# EAGLE design sterownik_led (EAGLE 9.5.2)
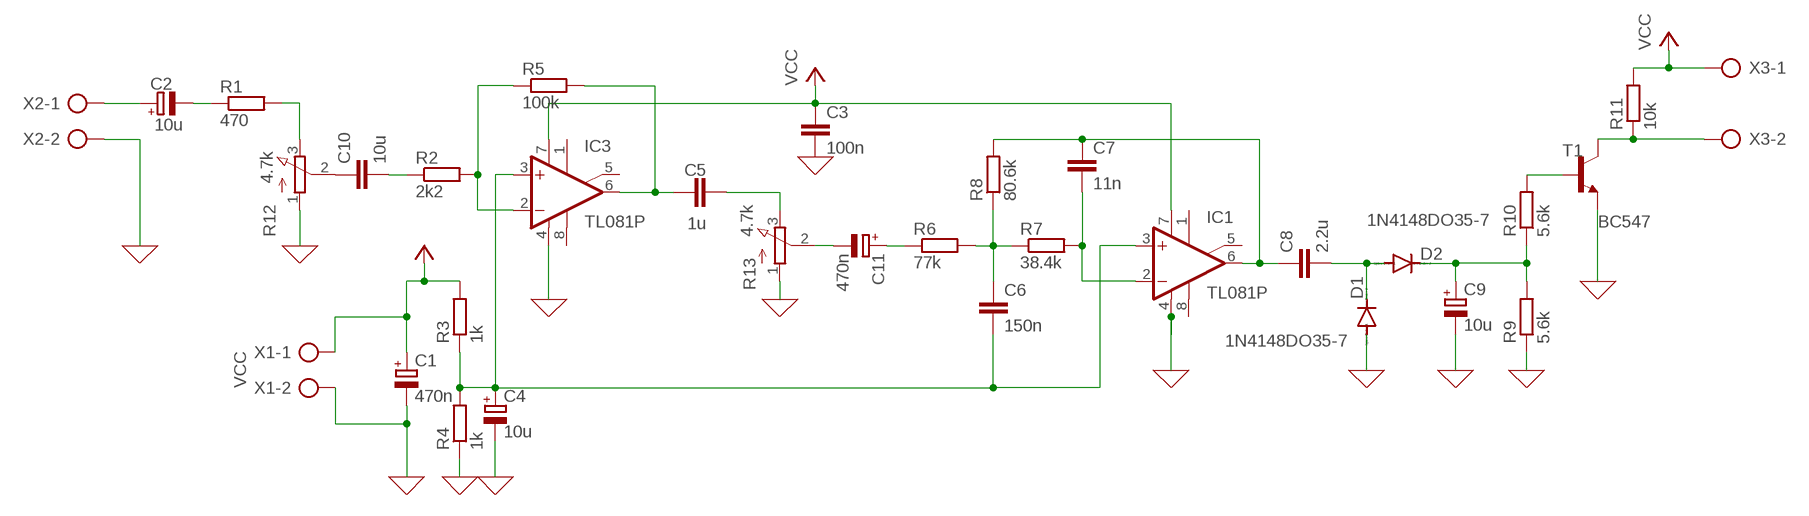
[diagram p0: schematic, sheet 1]

## Parts
C1  470n  CPOL-EUTT2D7  [TT2D7]
C2  10u  CPOL-EUTT2D7  [TT2D7]
C3  100n  C-EU025-025X050  [C025-025X050]
C4  10u  CPOL-EUTT2D7  [TT2D7]
C5  1u  C-EU025-025X050  [C025-025X050]
C6  150n  C-EU025-025X050  [C025-025X050]
C7  11n  C-EU025-025X050  [C025-025X050]
C8  2.2u  C-EU025-025X050  [C025-025X050]
C9  10u  CPOL-EUTT2D7  [TT2D7]
C10  10u  C-EU050-025X075  [C050-025X075]
C11  470n  CPOL-EUTT2D7  [TT2D7]
D1  1N4148DO35-7  [DO35-7]
D2  1N4148DO35-7  [DO35-7]
IC1  TL081P  [DIL08]
IC3  TL081P  [DIL08]
R1  470  R-EU_0207/10  [0207/10]
R2  2k2  R-EU_0207/10  [0207/10]
R3  1k  R-EU_0207/10  [0207/10]
R4  1k  R-EU_0207/10  [0207/10]
R5  100k  R-EU_0207/10  [0207/10]
R6  77k  R-EU_0207/10  [0207/10]
R7  38.4k  R-EU_0207/10  [0207/10]
R8  80.6k  R-EU_0207/10  [0207/10]
R9  5.6k  R-EU_0207/10  [0207/10]
R10  5.6k  R-EU_0207/10  [0207/10]
R11  10k  R-EU_0207/10  [0207/10]
R12  4.7k  3RP/1610N  [3RP/1610N]
R13  4.7k  3RP/1610N  [3RP/1610N]
T1  BC547  [TO92]
X1  AK500/2  [AK500/2]
X2  AK500/2  [AK500/2]
X3  AK500/2  [AK500/2]

## Nets
0: C1.- C3.2 C4.- C9.- D1.A IC1.4(V-) IC3.4(V-) R4.1 R9.1 R12.1(A) R13.1(A) T1.1(E) X1.2 X2.2 ; supply symbol labelled GND
JACK_VIN: C2.+ X2.1
N$1: C4.+ C6.2 IC1.3(+IN) IC3.3(+IN) R3.1 R4.2
N$2: R10.2 T1.2(B)
N$3: C10.1 R12.2(S)
N$4: C2.- R1.1
N$5: R1.2 R12.3(E)
N$6: C7.2 IC1.2(-IN) R7.2
N$8: C11.- R13.2(S)
N$9: C5.1 IC3.6(OUT) R5.2
N$10: C6.1 R6.2 R7.1 R8.1
N$12: C7.1 C8.1 IC1.6(OUT) R8.2
N$16: C8.2 D1.C D2.A
N$17: C9.+ D2.C R9.2 R10.1
N$18: C5.2 R13.3(E)
N$19: C10.2 R2.1
N$20: C11.+ R6.1
N$21: IC3.2(-IN) R2.2 R5.1
OUT: R11.1 T1.3(C) X3.2
VCC: C1.+ C3.1 IC1.7(V+) IC3.7(V+) R3.2 R11.2 X1.1 X3.1
Unconnected: IC1.1(ON1) IC1.5(ON2) IC1.8(OPT) IC3.1(ON1) IC3.5(ON2) IC3.8(OPT)

## Library data of the parts
C1 C2 C4 C9 C11 = rcl:CPOL-EU: POLARIZED CAPACITOR, European symbol; SPICEPREFIX: C
C3 C5-C8 C10 = rcl:C-EU: CAPACITOR, European symbol; SPICEPREFIX: C
D1 D2 = diode:1N4148: DIODE high speed (Philips)
IC1 IC3 = linear:TL081: OP AMP
R1-R11 = rcl:R-EU_: RESISTOR, European symbol; SPICEPREFIX: R
R12 R13 = pot:3RP/1610N: 16mm Potentiometer one level Source: http://www.alphapotentiometers.net/html/16mm_pot_2.html
T1 = transistor:BC547: NPN TRANSISTOR
X1-X3 = con-ptr500:AK500/2: CONNECTOR; OC_FARNELL: unknown; OC_NEWARK: unknown

## Board
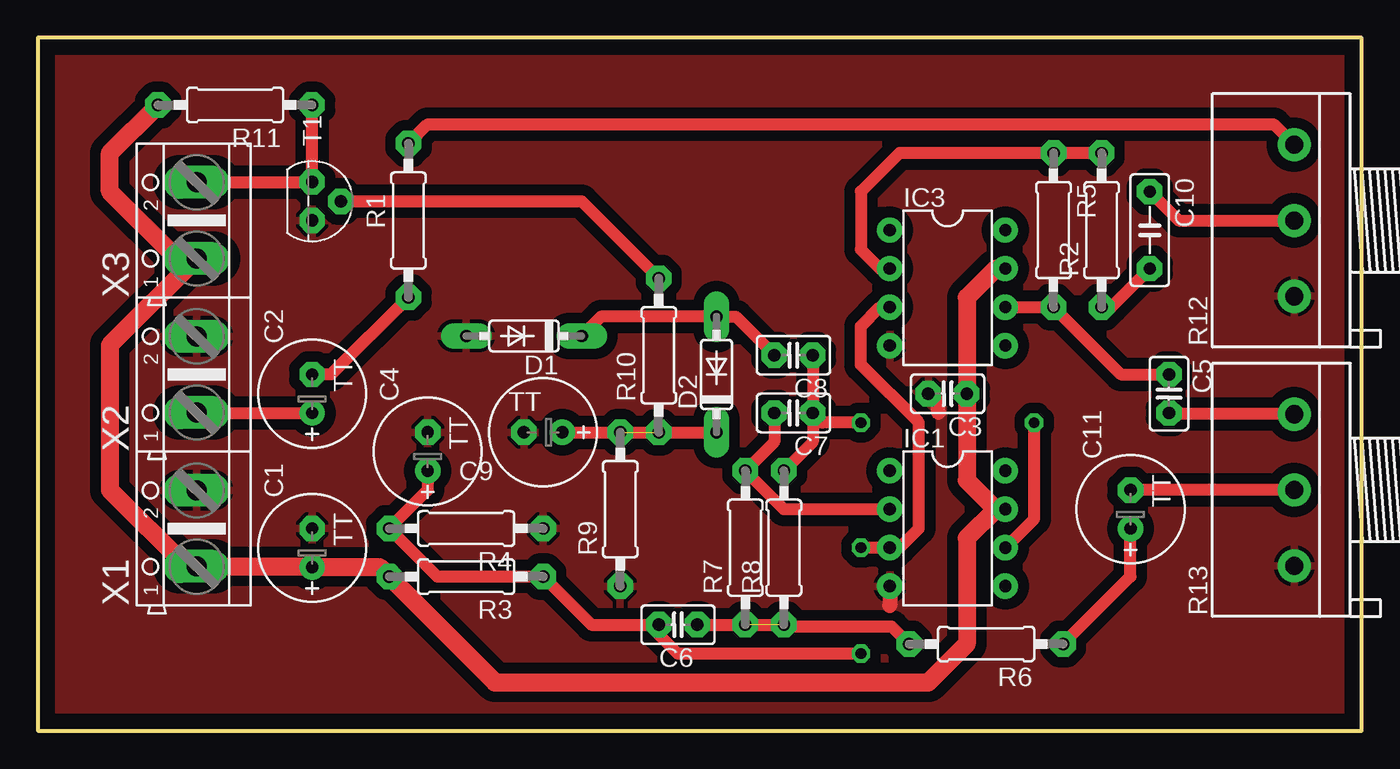
[diagram p1: board, top side]
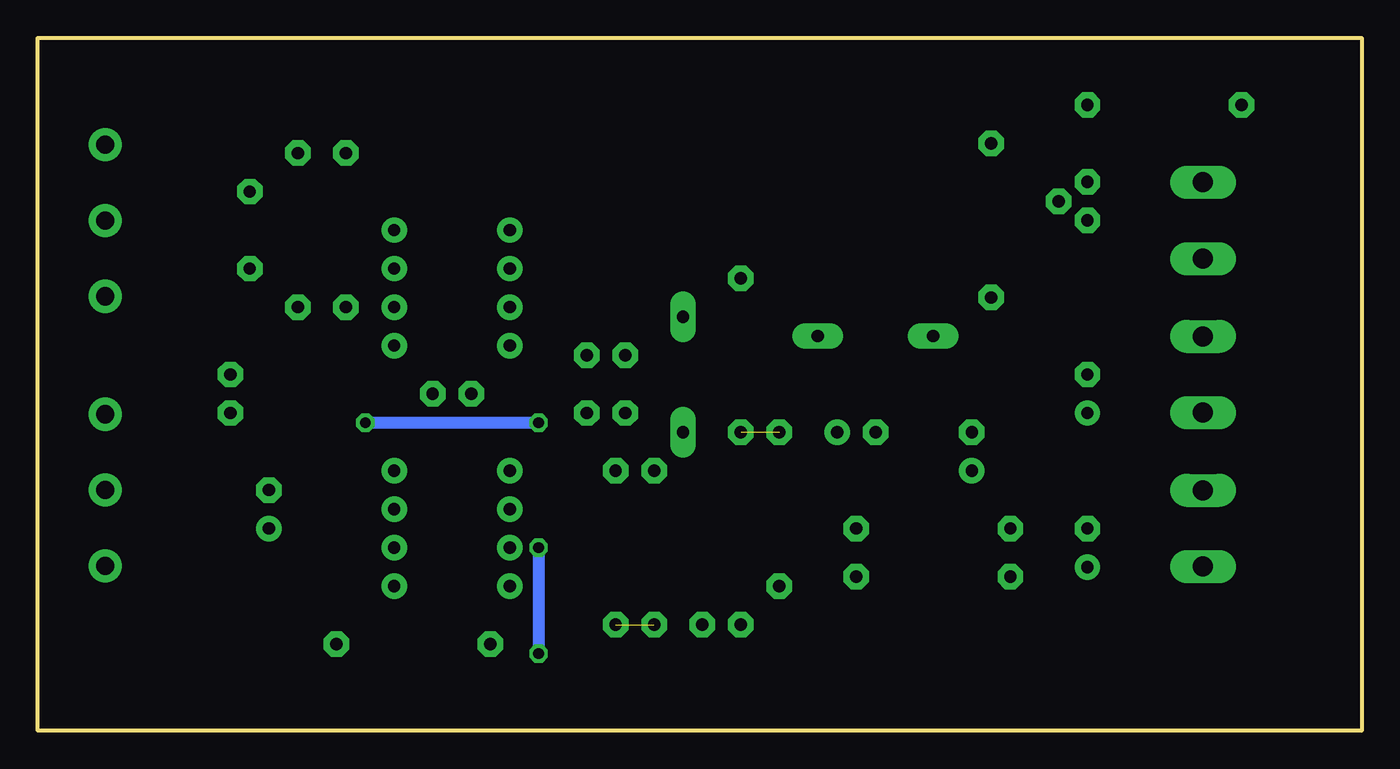
[diagram p2: board, bottom side, seen from below]

Size 87.3 x 45.7 mm. Coordinates in mm from the lower left corner, seen from the top.
Outline: 87.3,0 87.3,45.7 0,45.7 0,0 87.3,0
Copper layers (1*16): Top 0.035mm / dielectric 1.5mm / Bottom 0.035mm
Design rules "default *": minimum track width 6mil, minimum drill 0.35mm, track to track 0.5mm, track to pad 0.5mm, pad to pad 0.5mm, via to via 0.5mm, smd to smd 0.5mm, copper to edge 40mil, drill to drill 6mil, minimum pad ring 17mil, minimum via ring 10mil, stop-mask expansion 4mil, vias tented up to drill 0mil, thermal gap 10mil

### Footprints (pad centres in the part's own frame; a part is rotated, then mirrored left to right if it is on the bottom)
TT2D7 = drill 0.813: + -1.27,0 | drill 0.813 octagon: - 1.27,0
C025-025X050 = drill 0.813 octagon: 1 -1.27,0; 2 1.27,0
C050-025X075 = drill 0.813 octagon: 1 -2.54,0; 2 2.54,0
DO35-7 = drill 0.813 long: A 3.81,0; C -3.81,0
DIL08 = drill 0.813 pad 1.27: 1 -3.81,-3.81; 2 -1.27,-3.81; 3 1.27,-3.81; 4 3.81,-3.81; 5 3.81,3.81; 6 1.27,3.81; 7 -1.27,3.81; 8 -3.81,3.81
0207/10 = drill 0.813 octagon: 1 -5.08,0; 2 5.08,0
3RP/1610N = drill 1.2 pad 2.184: 1 -5,0; 2 0,0; 3 5,0
TO92 = drill 0.813 octagon: 1 1.27,0; 2 0,1.905; 3 -1.27,0
AK500/2 = drill 1.321 long: 1 -2.515,0; 2 2.515,0

### Placement (x,y rotation side)
C1  18.09,12.06 90 top
C2  18.09,22.22 90 top
C3  59.99,22.22 180 top
C4  25.71,18.41 90 top
C5  74.6,22.22 270 top
C6  42.22,6.98 180 top
C7  49.84,20.95 180 top
C8  49.84,24.77 180 top
C9  33.32,19.68 180 top
C10  73.33,33.02 270 top
C11  72.06,14.61 90 top
D1  32.05,26.04 180 top
D2  44.76,23.5 90 top
IC1  59.99,13.33 270 top
IC3  59.99,29.21 270 top
R1  24.44,33.66 90 top
R2  70.15,33.02 90 top
R3  28.25,10.16 180 top
R4  28.25,13.33 180 top
R5  66.98,33.02 270 top
R6  62.54,5.71 180 top
R7  46.66,12.06 90 top
R8  49.2,12.06 90 top
R9  38.41,14.61 90 top
R10  40.95,24.77 90 top
R11  13,41.28 180 top
R12  82.85,33.66 90 top
R13  82.85,15.88 90 top
T1  18.09,34.93 270 top
X1  10.46,13.33 90 top
X2  10.46,23.5 90 top
X3  10.46,33.66 90 top

### Tracks (layer width: path | path; a pad name or v marks a point on that pad's centre or on a via)
0
  Top 0.8: 10.46,26.04 X2.2
  Top 1: C3.2 59.36,21.59 59.36,21.03 59.4,20.99 | IC1.4 56.19,8.26
  pour Top (isolate 0.7): -0.33,45.72 87.3,45.72 87.3,0 -0.33,0
JACK_VIN
  Top 0.8: X2.1 10.49,20.95 C2.+
N$1  (via drill 0.7)
  Top 0.8: C4.+ 25.71,15.88 R4.2 26.34,10.16 R3.1 36.5,6.98 C6.2 40.95,6.35 42.22,5.08 v54.28,5.08 | v54.28,12.06 IC1.3 56.82,12.06 58.09,13.33 58.09,20.32 54.28,24.13 54.28,26.67 55.55,27.94 IC3.3
  Bottom 0.8: v54.28,12.06 v54.28,5.08
N$2
  Top 0.8: T1.2 35.87,34.93 R10.2
N$3
  Top 0.8: R12.2 75.23,33.66 C10.1
N$4
  Top 0.8: R1.1 19.36,23.5 C2.-
N$5
  Top 0.8: R1.2 25.71,40.01 81.5,40.01 R12.3
N$6
  Top 0.8: C7.2 48.56,19.05 R7.2 49.2,14.61 IC1.2
N$8
  Top 0.8: R13.2 C11.-
N$9
  Top 0.8: C5.1 71.42,23.5 R5.2 IC3.6
N$10  (1 unrouted)
  Top 0.8: C6.1 R8.1 49.33,6.86 56.31,6.86 R6.2
N$12  (via drill 0.7)
  Top 0.8: C7.1 51.11,19.05 R8.2 | C8.1 C7.1 | IC1.6 65.71,13.97 v65.71,20.32 | v54.28,20.32 51.74,20.32 C7.1
  Bottom 0.8: v65.71,20.32 v54.28,20.32
N$16
  Top 0.8: D1.C 37.13,27.3 D2.A 46.02,27.3 C8.2
N$17  (1 unrouted)
  Top 0.8: C9.+ R9.2 D2.C
N$18
  Top 0.8: R13.3 74.68,20.88 C5.2
N$19
  Top 0.8: C10.2 70.79,27.94 R2.1
N$20
  Top 0.8: R6.1 72.06,10.16 C11.+
N$21
  Top 0.8: R2.2 R5.1 56.82,38.1 54.28,35.56 54.28,31.75 55.55,30.48 IC3.2
OUT
  Top 0.8: X3.2 10.49,36.2 T1.3 R11.1
VCC
  Top 0.635: X3.1 5.38,26.06
  Top 1.2: X1.1 10.49,10.79 | X1.1 18.06,10.82 C1.+ 22.53,10.79 R3.2 30.15,3.17 58.73,3.17 61.27,5.71 61.27,12.7 63.17,14.61 | 63.17,14.61 IC1.7 | 63.17,14.61 61.27,16.51 C3.1 61.27,28.57 63.17,30.48 IC3.7 | X1.1 9.8,10.82 4.75,15.88 4.75,25.43 X3.1 9.17,31.14 4.75,35.56 4.75,38.1 R11.2